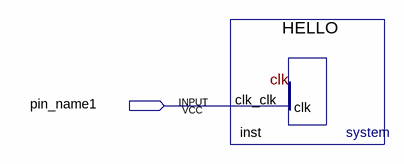
[diagram p0: schematic sheet]
// Quartus schematic HELLOWORLD.bdf as structural Verilog: 1 symbols, 1 pins
module HELLOWORLD (
  input  pin_name1
);

  HELLO inst (.clk_clk(pin_name1));
endmodule
